# Altium project cntrler.PrjPcb
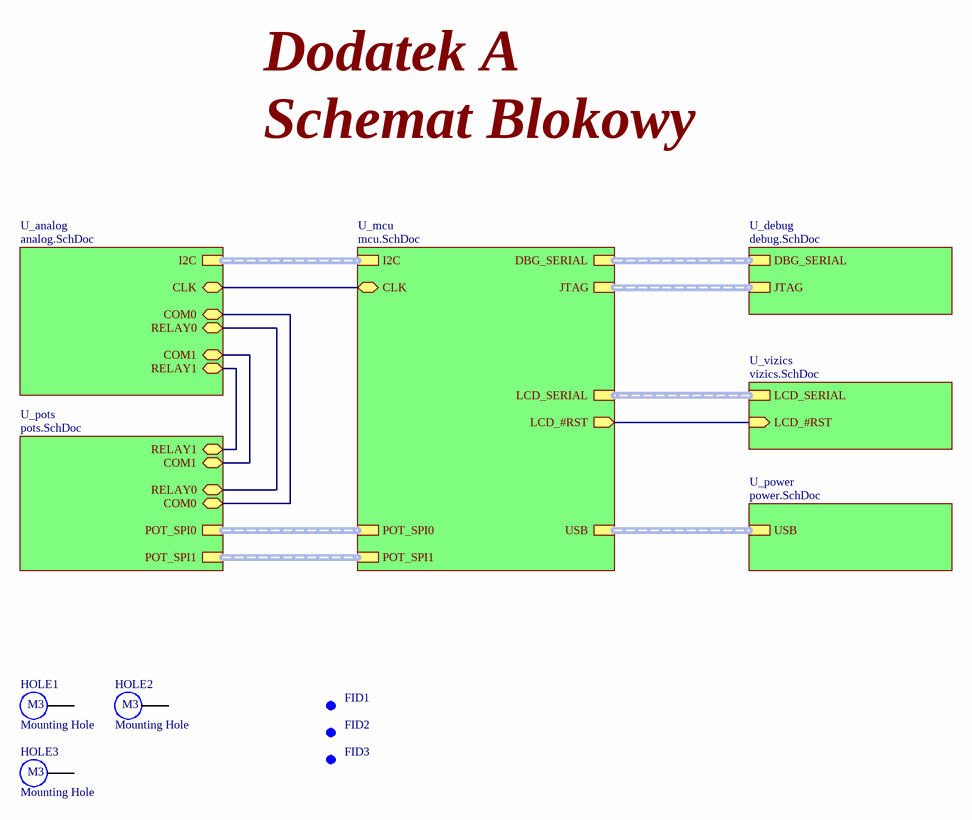
[diagram p0: sntrler.SchDoc]
7 sheets, 170 parts. Net scope: hierarchical (ports join the sheet entries above them; power ports are global).
Board file: pycyby.PcbDoc
Sheets:
  sntrler.SchDoc
    U_analog = analog.SchDoc
    U_mcu = mcu.SchDoc
    U_debug = debug.SchDoc
    U_pots = pots.SchDoc
    U_power = power.SchDoc
    U_vizics = vizics.SchDoc

## Sheet sntrler.SchDoc: Scalony Skaner Bioimpedancji
size A4; DrawnBy: Łukasz Przeniosło; Organization: Zachodniopomorski; Address1: Uniwersytet Technologiczny; Address2: w Szczecinie; Address3: Wydział Elektryczny; Address4: Katedra KISSE; Revision: 1.0; SheetNumber: 1; SheetTotal: 7

### Parts
FID1  Fiducial  [Fid Round]  (value not drawn)  (no BOM)
FID2  Fiducial  [Fid Round]  (value not drawn)  (no BOM)
FID3  Fiducial  [Fid Round]  (value not drawn)  (no BOM)
HOLE1  Mounting Hole  [Hole3.2x6mm]  (no BOM)
HOLE2  Mounting Hole  [Hole3.2x6mm]  (no BOM)
HOLE3  Mounting Hole  [Hole3.2x6mm]  (no BOM)

### Sub-sheets
U_analog = analog.SchDoc: I2C (harness I2C), COM0 (bidir), RELAY0 (bidir), COM1 (bidir), RELAY1 (bidir), CLK (bidir)
U_debug = debug.SchDoc: DBG_SERIAL (harness DBG_SERIAL), JTAG (harness JTAG)
U_mcu = mcu.SchDoc: JTAG (harness JTAG), LCD_SERIAL (harness LCD_SERIAL), I2C (harness I2C), DBG_SERIAL (harness DBG_SERIAL), POT_SPI0 (harness POT_SPI0), USB (harness USB), LCD_#RST (out), POT_SPI1 (harness POT_SPI1), CLK (bidir)
U_pots = pots.SchDoc: POT_SPI0 (harness POT_SPI0), POT_SPI1 (harness POT_SPI1), COM0 (bidir), RELAY0 (bidir), COM1 (bidir), RELAY1 (bidir)
U_power = power.SchDoc: USB (harness USB)
U_vizics = vizics.SchDoc: LCD_SERIAL (harness LCD_SERIAL), LCD_#RST (in)

### Nets
CLK: sheet U_analog/CLK, sheet U_mcu/CLK
COM0: sheet U_analog/COM0, sheet U_pots/COM0
COM1: sheet U_analog/COM1, sheet U_pots/COM1
LCD_#RST: sheet U_mcu/LCD_#RST, sheet U_vizics/LCD_#RST
MUT_IN0: sheet U_analog/RELAY0, sheet U_pots/RELAY0
MUT_IN1: sheet U_analog/RELAY1, sheet U_pots/RELAY1

Not connected (* = marked no-connect by the designer): HOLE1 0; HOLE2 0; HOLE3 0

### Buses and harness runs
harness sheet U_analog/I2C = sheet U_mcu/I2C
harness sheet U_debug/DBG_SERIAL = sheet U_mcu/DBG_SERIAL
harness sheet U_debug/JTAG = sheet U_mcu/JTAG
harness sheet U_mcu/LCD_SERIAL = sheet U_vizics/LCD_SERIAL
harness sheet U_mcu/POT_SPI0 = sheet U_pots/POT_SPI0
harness sheet U_mcu/POT_SPI1 = sheet U_pots/POT_SPI1
harness sheet U_mcu/USB = sheet U_power/USB

### Notes on the sheet
- Dodatek A
- Schemat Blokowy
- Title
- Size:
- Date:
- A4
- Author:
- Time:
- Sheet
- of
- File:
- (in symbol HOLE M3) M3

### Library data of the parts
FID1-FID3 = FID ROUND: round fiducial
HOLE1-HOLE3 = HOLE M3

## Sheet analog.SchDoc: Scalony Skaner Bioimpedancji
size A4; DrawnBy: Łukasz Przeniosło; Organization: Zachodniopomorski; Address1: Uniwersytet Technologiczny; Address2: w Szczecinie; Address3: Wydział Elektryczny; Address4: Katedra KISSE; Revision: 1.0; SheetNumber: 3; SheetTotal: 7
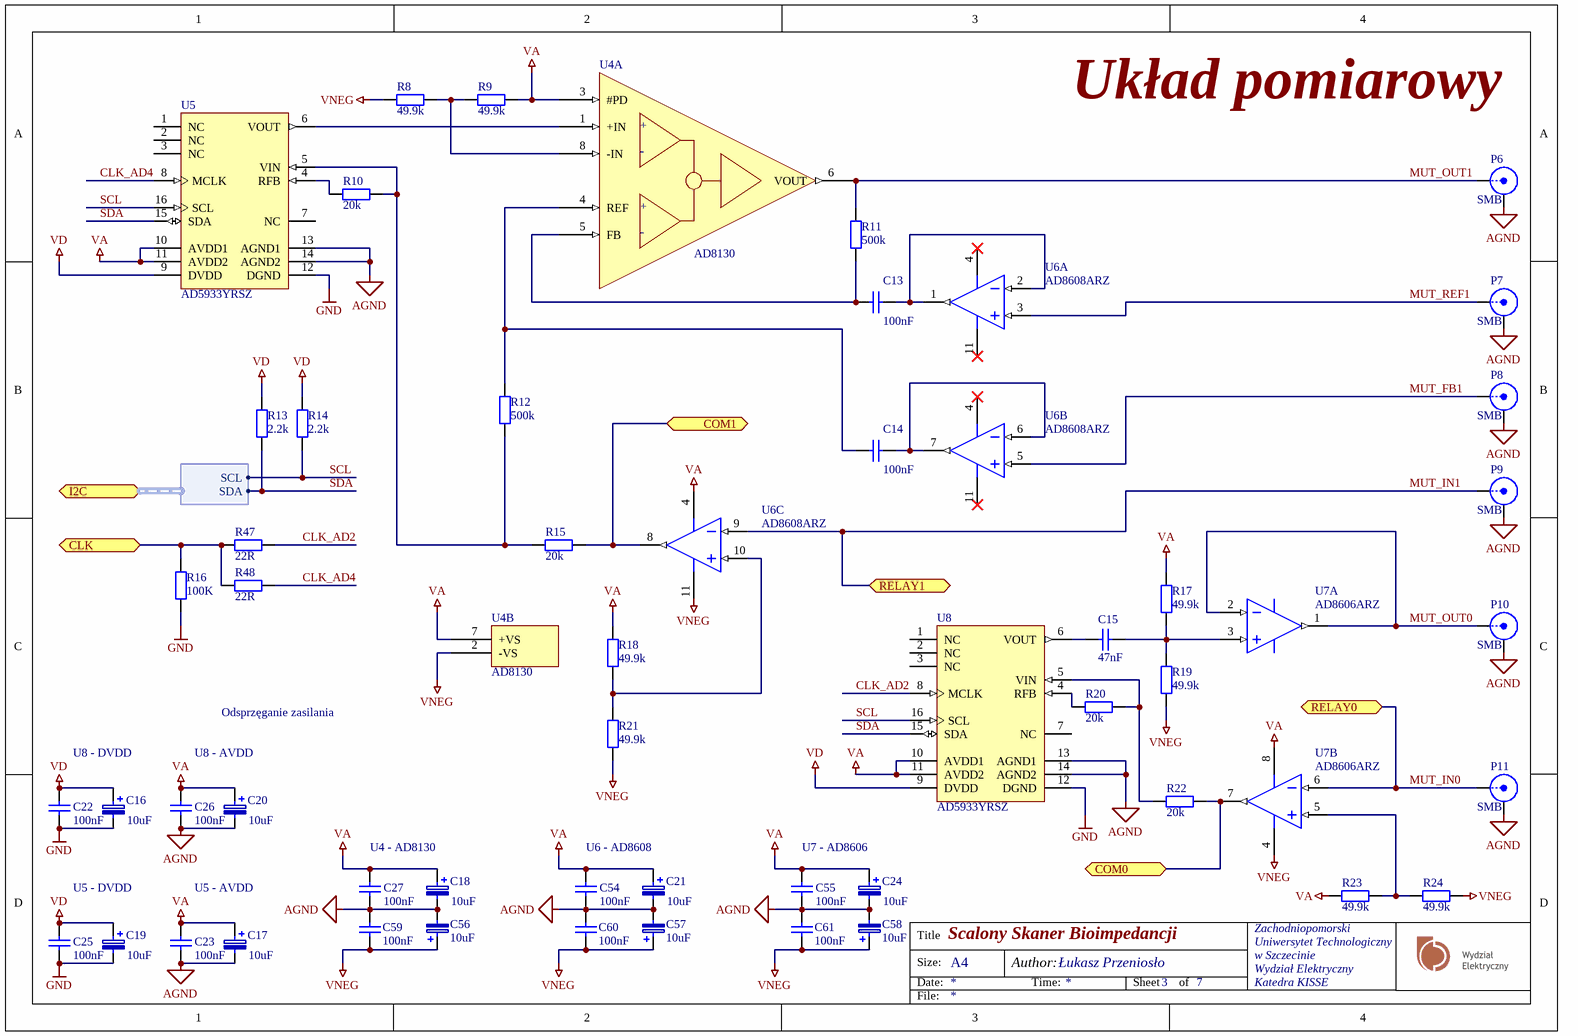
[diagram p1: analog.SchDoc]

### Parts
(Parts that share a designator on the sheet are numbered #1, #2 ... from top to bottom, then left to right.)
C13  100nF  [CAPC1608N]
C14  100nF  [CAPC1608N]
C15  47nF  [CAPC1608N]
C16  10uF  [SMDA]
C17  10uF  [SMDA]
C18  10uF  [SMDA]
C19  10uF  [SMDA]
C20  10uF  [SMDA]
C21  10uF  [SMDA]
C22  100nF  [CAPC1608N]
C23  100nF  [CAPC1608N]
C24  10uF  [SMDA]
C25  100nF  [CAPC1608N]
C26  100nF  [CAPC1608N]
C27  100nF  [CAPC1608N]
C54  100nF  [CAPC1608N]
C55  100nF  [CAPC1608N]
C56  10uF  [SMDA]
C57  10uF  [SMDA]
C58  10uF  [SMDA]
C59  100nF  [CAPC1608N]
C60  100nF  [CAPC1608N]
C61  100nF  [CAPC1608N]
P6  SMB  [SMB_V-RJ45]
P7  SMB  [SMB_V-RJ45]
P8  SMB  [SMB_V-RJ45]
P9  SMB  [SMB_V-RJ45]
P10  SMB  [SMB_V-RJ45]
P11  SMB  [SMB_V-RJ45]
R8  49.9k  [RESC1608N]
R9  49.9k  [RESC1608N]
R10  20k  [RESC1608N]
R11  500k  [RESC1608N]
R12  500k  [RESC1608N]
R13  2.2k  [RESC1608N]
R14  2.2k  [RESC1608N]
R15  20k  [RESC1608N]
R16  100K  [RESC1608N]
R17  49.9k  [RESC1608N]
R18  49.9k  [RESC1608N]
R19  49.9k  [RESC1608N]
R20  20k  [RESC1608N]
R21  49.9k  [RESC1608N]
R22  20k  [RESC1608N]
R23  49.9k  [RESC1608N]
R24  49.9k  [RESC1608N]
R47  22R  [RESC1608N]
R48  22R  [RESC1608N]
U4  AD8130  [SO-8_M]  (parts A,B of 2)
U5  AD5933YRSZ  [ADI-RS-16_L]
U6  AD8608ARZ  [ADI-R-14_N]  (parts A,B,C of 4)
U7#1  AD8606ARZ  [SOIC127P600-8AL]  (part A of 2)
U7#2  AD8606ARZ  [SOIC127P600-8AL]  (part B of 2)
U8  AD5933YRSZ  [ADI-RS-16_L]

### Ports
CLK, COM0, COM1, I2C (harness I2C), RELAY0, RELAY1

### Harnesses
I2C: SCL, SDA

### Nets
AGND: C17.2 C18.2 C20.2 C21.2 C23.1 C24.2 C26.1 C27.1 C54.1 C55.1 C56.2 C57.2 C58.2 C59.1 C60.1 C61.1 P6.2(Y) P7.2(Y) P8.2(Y) P9.2(Y) P10.2(Y) P11.2(Y) U5.13(AGND1) U5.14(AGND2) U8.13(AGND1) U8.14(AGND2)
GND: C16.2 C19.2 C22.1 C25.1 R16.2 U5.12(DGND) U8.12(DGND)
VA: C17.1 C18.1 C20.1 C21.1 C23.2 C24.1 C26.2 C27.2 C54.2 C55.2 R9.1 R17.1 R18.1 R23.1 U4.3(#PD) U4.7(+VS) U5.10(AVDD1) U5.11(AVDD2) U6.4(+V) U7#2.8(+V) U8.10(AVDD1) U8.11(AVDD2)
VD: C16.1 C19.1 C22.2 C25.2 R13.1 R14.1 U5.9(DVDD) U8.9(DVDD)
VNEG: C56.1 C57.1 C58.1 C59.2 C60.2 C61.2 R8.2 R19.2 R21.2 R24.2 U4.2(-VS) U6.11(-V) U7#2.4(-V)
CLK: R16.1 R47.2 R48.2 ; port CLK
CLK_AD2: R47.1 U8.8(MCLK)
CLK_AD4: R48.1 U5.8(MCLK)
COM0: R22.1 U7#2.7(OUT_B) ; port COM0
COM1: R15.1 U6.8(OUT_C) ; port COM1
MUT_FB1: P8.1(X) U6.5(+IN_B)
MUT_IN0: P11.1(X) U7#2.6(-IN_B) ; port RELAY0
MUT_IN1: P9.1(X) U6.9(-IN_C) ; port RELAY1
MUT_OUT0: P10.1(X) U7#1.1(OUT_A) U7#1.2(-IN_A)
MUT_OUT1: P6.1(X) R11.1 U4.6(VOUT)
MUT_REF1: P7.1(X) U6.3(+IN_A)
SCL: R14.2 U5.16(SCL) U8.16(SCL) ; port I2C.SCL
SDA: R13.2 U5.15(SDA) U8.15(SDA) ; port I2C.SDA
NetC13_1: C13.1 U6.1(OUT_A) U6.2(-IN_A)
NetC13_2: C13.2 R11.2 U4.5(FB)
NetC14_1: C14.1 U6.6(-IN_B) U6.7(OUT_B)
NetC14_2: C14.2 R12.1 U4.4(REF)
NetC15_1: C15.1 R17.2 R19.1 U7#1.3(+IN_A)
NetC15_2: C15.2 U8.6(VOUT)
NetR8_1: R8.1 R9.2 U4.8(-IN)
NetR10_1: R10.1 R12.2 R15.2 U5.5(VIN)
NetR10_2: R10.2 U5.4(RFB)
NetR18_2: R18.2 R21.1 U6.10(+IN_C)
NetR20_1: R20.1 U8.4(RFB)
NetR20_2: R20.2 R22.2 U8.5(VIN)
NetR23_2: R23.2 R24.1 U7#2.5(+IN_B)
NetU4_1: U4.1(+IN) U5.6(VOUT)

Not connected (* = marked no-connect by the designer): U5 1(NC) 2(NC) 3(NC) 7(NC); U7#1 4(-V) 8(+V); U8 1(NC) 2(NC) 3(NC) 7(NC)

### Notes on the sheet
- Układ pomiarowy
- Odsprzęganie zasilania
- U8 - DVDD
- U8 - AVDD
- U4 - AD8130
- U6 - AD8608
- U7 - AD8606
- U5 - DVDD
- U5 - AVDD
- Title
- Size:
- Date:
- A4
- Author:
- Time:
- Sheet
- of
- File:
- (in symbol AD8130, part A) +; -

### Library data of the parts
C13-C15 C22 C23 C25-C27 C54 C55 C59-C61 = Capacitor
  C13 C14 C22 C23 C25-C27 C54 C55 C59-C61: Value: 100nF
  C15: Value: 47nF
C16-C21 C24 C56-C58 = 100uF 6.3V-SMDB: Polarized Capacitor (Surface Mount); PackageReference: SMDB; Manufacturer: *; Manufacturer Part No.: *; Distributor: tme.pl; Distributor Order Code: TC 100/6.3-SMDB; tme.pl: TC 100/6.3-SMDB; Value: 10uF; farnell: 1135048
P6-P11 = SMB: SMB Straight Connector; LatestRevisionDate: 17-Jul-2002; LatestRevisionNote: Re-released for DXP Platform.; Publisher: Altium Limited
R8-R12 R15 R17-R24 R47 R48 = Resistor: Tolerance: 5%; Power: 0W
  R8 R9 R17-R19 R21 R23 R24: Value: 49.9k
  R10 R15 R20 R22: Value: 20k
  R11 R12: Value: 500k
  R47 R48: Value: 22R
R13 R14 R16 = Resistor: Power: 0W; Tolerance: 5%
  R13 R14: Value: 2.2k
  R16: Value: 100K
U5 U8 = CMP-0293-00046-1: 1 MSPS, 12-Bit Impedance Converter, Network Analyzer, Serial, RS-16, 77 Tube, Pb-Free; Tuning Word Width (bits): 27bit; I Supply total (max): 15mA; Master fclk: 16.776MHz; Resolution (Bits): 12bit; PackageVersion: 3/17/2005; I/O Interface: Serial; ComponentLink2URL: http://www.analog.com/static/imported-files/data_sheets/AD5933.pdf; PackageReference: RS-16; ComponentLink2Description: Datasheet; ComponentLink1URL: www.analog.com; Code_JEDEC: MO-150-AC; PackageDescription: 16-Lead Shrink Small Outline Package [SSOP]; ComponentLink1Description: Manufacturer URL; ComponentLink3URL: http://www.analog.com/static/imported-files/packages/31572257652246RS_16.pdf; ComponentLink3Description: Package Specification; DatasheetVersion: Rev. D
U6 = CMP-0384-00479-2: Quad Channel Wide Bandwidth Operational Amplifier, 10 MHz BW, 5 V/us SR, Industrial, 14-pin SOIC (R-14), Tube; Manufacturer: Analog Devices; Generic Part Number: AD8608; V Span Min: 2.7V; V Span Max: 6V; Input Bias Current: 200fA; Amplifiers Per Package: 4; Small Signal Bandwidth: 10MHz; Input Offset Voltage: 20uV; Slew Rate: 5V/us; Iq/Amp: 1.2mA; PackageReference: R-14; Mounting Technology: Surface Mount; ComponentLink3URL: http://www.analog.com/static/imported-files/packages/PKG_PDF/SOIC_Narrow%20(R)/R_14.pdf; ComponentLink1Description: Manufacturer URL; PackageVersion: 060606-A; ComponentLink3Description: Package Specification; ComponentLink1URL: http://www.analog.com/en/index.html; ComponentLink4Description: Reference Circuit; ComponentLink2URL: http://www.analog.com/static/imported-files/data_sheets/AD8605_8606_8608.pdf; DatasheetVersion: Rev. L; RevisionNote: Reference Circuit URL fixed; PackageDescription: 14-Pin Standard Small Outline Package, Body 8.65 x 3.9 mm, Pitch 1.27 mm; ComponentLink2Description: Datasheet; Code_JEDEC: MS-012-AB; PartNumber: AD8608ARZ; ComponentLink4URL: http://www.analog.com/en/all-operational-amplifiers-op-amps/operational-amplifiers-op-amps/ad8608/products/product.html#product-recommendations
U7#1 U7#2 = CMP-0384-01321-1: Double Channel Wide Bandwidth Operational Amplifier, 10 MHz BW, 5 V/us SR, Industrial, 8-pin SOIC (R-8), Tube; Generic Part Number: AD8606; Manufacturer: Analog Devices; Small Signal Bandwidth: 10MHz; V Span Min: 2.7V; Input Offset Voltage: 20uV; Amplifiers Per Package: 2; Iq/Amp: 1.2mA; Input Bias Current: 200fA; V Span Max: 6V; Slew Rate: 5V/us; ComponentLink3URL: http://www.analog.com/static/imported-files/packages/PKG_PDF/SOIC_Narrow%20(R)/R_8.pdf; Code_JEDEC: MS-012-AA; Mounting Technology: Surface Mount; PackageVersion: 060506-A; ComponentLink1URL: http://www.analog.com/en/index.html; PackageDescription: 8-Pin Standard Small Outline Package, Body 3.9 x 4.9 mm, Pitch 1.27 mm; ComponentLink4URL: Reference Circuit:http://www.analog.com/en/all-operational-amplifiers-op-amps/operational-amplifiers-op-amps/ad8606/products/product.html#product-recommendations; ComponentLink3Description: Package Specification; ComponentLink1Description: Manufacturer URL; ComponentLink2URL: http://www.analog.com/static/imported-files/data_sheets/AD8605_8606_8608.pdf; ComponentLink2Description: Datasheet; PartNumber: AD8606ARZ; ComponentLink4Description: URL Link1; DatasheetVersion: Rev. L; PackageReference: R-8

## Sheet mcu.SchDoc: Scalony Skaner Bioimpedancji
size A4; DrawnBy: Łukasz Przeniosło; Organization: Zachodniopomorski; Address1: Uniwersytet Technologiczny; Address2: w Szczecinie; Address3: Wydział Elektryczny; Address4: Katedra KISSE; Revision: 1.0; SheetNumber: 4; SheetTotal: 7
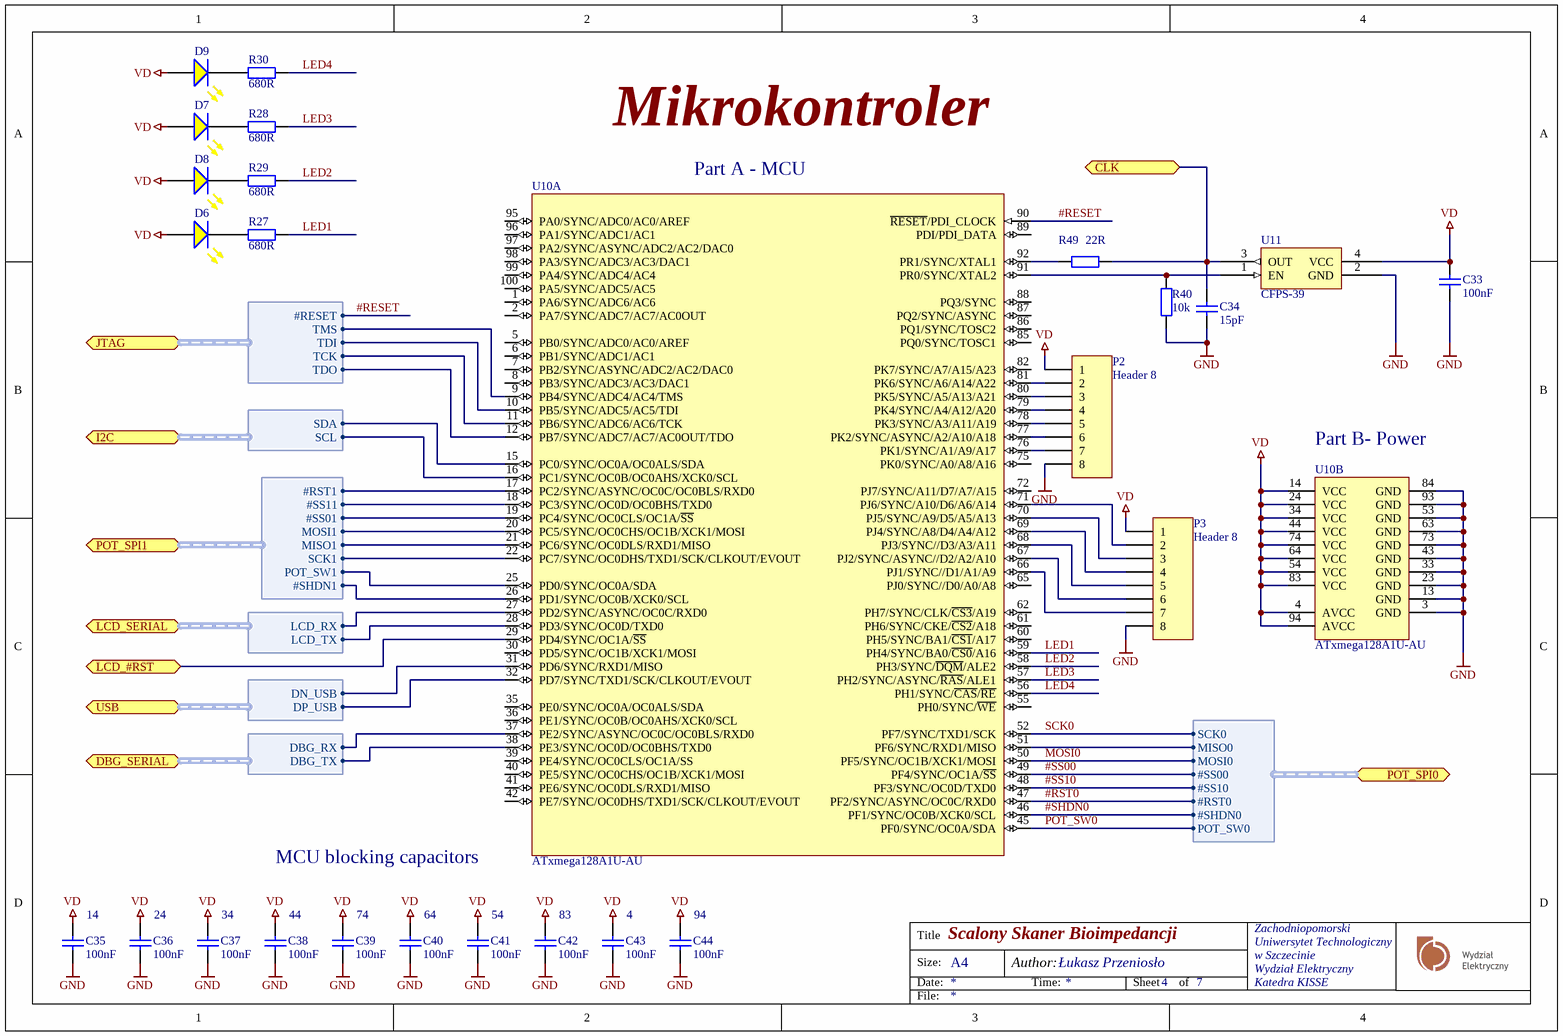
[diagram p2: mcu.SchDoc]

### Parts
C33  100nF  [CAPC1608N]
C34  15pF  [CAPC1608N]
C35  100nF  [CAPC1608N]
C36  100nF  [CAPC1608N]
C37  100nF  [CAPC1608N]
C38  100nF  [CAPC1608N]
C39  100nF  [CAPC1608N]
C40  100nF  [CAPC1608N]
C41  100nF  [CAPC1608N]
C42  100nF  [CAPC1608N]
C43  100nF  [CAPC1608N]
C44  100nF  [CAPC1608N]
D6  LED_YELLOW  [KPA-3010SGD]  (value not drawn)
D7  LED_YELLOW  [KPA-3010SGD]  (value not drawn)
D8  LED_YELLOW  [KPA-3010SGD]  (value not drawn)
D9  LED_YELLOW  [KPA-3010SGD]  (value not drawn)
P2  Header 8  [HDR1X8]
P3  Header 8  [HDR1X8]
R27  680R  [RESC1608N]
R28  680R  [RESC1608N]
R29  680R  [RESC1608N]
R30  680R  [RESC1608N]
R40  10k  [RESC1608N]
R49  22R  [RESC1608N]
U10  ATxmega128A1U-AU  [100A_MOJE]  (parts A,B of 2)
U11  CFPS-39  [ECX32]

### Ports
CLK, DBG_SERIAL (harness DBG_SERIAL), I2C (harness I2C), JTAG (harness JTAG), LCD_#RST, LCD_SERIAL (harness LCD_SERIAL), POT_SPI0 (harness POT_SPI0), POT_SPI1 (harness POT_SPI1), USB (harness USB)

### Harnesses
JTAG: TMS, TCK, TDI, TDO, #RESET
LCD_SERIAL: LCD_TX, LCD_RX
I2C: SDA, SCL
DBG_SERIAL: DBG_TX, DBG_RX
POT_SPI0: MISO0, MOSI0, SCK0, #SS00, #SS10, #RST0, #SHDN0, POT_SW0
USB: DP_USB, DN_USB
POT_SPI1: MISO1, MOSI1, SCK1, #SS01, #SS11, #RST1, #SHDN1, POT_SW1

### Nets
GND: C33.1 C34.1 C35.1 C36.1 C37.1 C38.1 C39.1 C40.1 C41.1 C42.1 C43.1 C44.1 P2.8 P3.8 R40.1 U10.3(GND) U10.13(GND) U10.23(GND) U10.33(GND) U10.43(GND) U10.53(GND) U10.63(GND) U10.73(GND) U10.84(GND) U10.93(GND) U11.2(GND)
VD: C33.2 C35.2 C36.2 C37.2 C38.2 C39.2 C40.2 C41.2 C42.2 C43.2 C44.2 D6.1(A) D7.1(A) D8.1(A) D9.1(A) P2.1 P3.1 U10.4(AVCC) U10.14(VCC) U10.24(VCC) U10.34(VCC) U10.44(VCC) U10.54(VCC) U10.64(VCC) U10.74(VCC) U10.83(VCC) U10.94(AVCC) U11.4(VCC)
#RESET: U10.90(~{RESET}/PDI_CLOCK) ; port JTAG.#RESET
#RST0: U10.47(PF2/SYNC/ASYNC/OC0C/RXD0) ; port POT_SPI0.#RST0
#RST1: U10.17(PC2/SYNC/ASYNC/OC0C/OC0BLS/RXD0) ; port POT_SPI1.#RST1
#SHDN0: U10.46(PF1/SYNC/OC0B/XCK0/SCL) ; port POT_SPI0.#SHDN0
#SHDN1: U10.26(PD1/SYNC/OC0B/XCK0/SCL) ; port POT_SPI1.#SHDN1
#SS00: U10.49(PF4/SYNC/OC1A/~{SS}) ; port POT_SPI0.#SS00
#SS01: U10.19(PC4/SYNC/OC0CLS/OC1A/~{SS}) ; port POT_SPI1.#SS01
#SS10: U10.48(PF3/SYNC/OC0D/TXD0) ; port POT_SPI0.#SS10
#SS11: U10.18(PC3/SYNC/OC0D/OC0BHS/TXD0) ; port POT_SPI1.#SS11
CLK: C34.2 R49.1 U11.3(OUT) ; port CLK
DBG_RX: U10.37(PE2/SYNC/ASYNC/OC0C/OC0BLS/RXD0) ; port DBG_SERIAL.DBG_RX
DBG_TX: U10.38(PE3/SYNC/OC0D/OC0BHS/TXD0) ; port DBG_SERIAL.DBG_TX
LCD_#RST: U10.29(PD4/SYNC/OC1A/~{SS}) ; port LCD_#RST
LCD_RX: U10.27(PD2/SYNC/ASYNC/OC0C/RXD0) ; port LCD_SERIAL.LCD_RX
LCD_TX: U10.28(PD3/SYNC/OC0D/TXD0) ; port LCD_SERIAL.LCD_TX
LED1: R27.1 U10.59(PH4/SYNC/BA0/~{CS0}/A16)
LED2: R29.1 U10.58(PH3/SYNC/~{DQM}/ALE2)
LED3: R28.1 U10.57(PH2/SYNC/ASYNC/~{RAS}/ALE1)
LED4: R30.1 U10.56(PH1/SYNC/~{CAS}/~{RE})
MOSI0: U10.50(PF5/SYNC/OC1B/XCK1/MOSI) ; port POT_SPI0.MOSI0
MOSI1: U10.20(PC5/SYNC/OC0CHS/OC1B/XCK1/MOSI) ; port POT_SPI1.MOSI1
POT_SW0: U10.45(PF0/SYNC/OC0A/SDA) ; port POT_SPI0.POT_SW0
POT_SW1: U10.25(PD0/SYNC/OC0A/SDA) ; port POT_SPI1.POT_SW1
SCK0: U10.52(PF7/SYNC/TXD1/SCK) ; port POT_SPI0.SCK0
SCK1: U10.22(PC7/SYNC/OC0DHS/TXD1/SCK/CLKOUT/EVOUT) ; port POT_SPI1.SCK1
SCL: U10.16(PC1/SYNC/OC0B/OC0AHS/XCK0/SCL) ; port I2C.SCL
SDA: U10.15(PC0/SYNC/OC0A/OC0ALS/SDA) ; port I2C.SDA
TCK: U10.11(PB6/SYNC/ADC6/AC6/TCK) ; port JTAG.TCK
TDI: U10.10(PB5/SYNC/ADC5/AC5/TDI) ; port JTAG.TDI
TDO: U10.12(PB7/SYNC/ADC7/AC7/AC0OUT/TDO) ; port JTAG.TDO
TMS: U10.9(PB4/SYNC/ADC4/AC4/TMS) ; port JTAG.TMS
NetD6_2: D6.2(K) R27.2
NetD7_2: D7.2(K) R28.2
NetD8_2: D8.2(K) R29.2
NetD9_2: D9.2(K) R30.2
NetP2_2: P2.2 U10.81(PK6/SYNC/A6/A14/A22)
NetP2_3: P2.3 U10.80(PK5/SYNC/A5/A13/A21)
NetP2_4: P2.4 U10.79(PK4/SYNC/A4/A12/A20)
NetP2_5: P2.5 U10.78(PK3/SYNC/A3/A11/A19)
NetP2_6: P2.6 U10.77(PK2/SYNC/ASYNC/A2/A10/A18)
NetP2_7: P2.7 U10.76(PK1/SYNC/A1/A9/A17)
NetP3_2: P3.2 U10.71(PJ6/SYNC/A10/D6/A6/A14)
NetP3_3: P3.3 U10.70(PJ5/SYNC/A9/D5/A5/A13)
NetP3_4: P3.4 U10.69(PJ4/SYNC/A8/D4/A4/A12)
NetP3_5: P3.5 U10.68(PJ3/SYNC//D3/A3/A11)
NetP3_6: P3.6 U10.67(PJ2/SYNC/ASYNC//D2/A2/A10)
NetP3_7: P3.7 U10.66(PJ1/SYNC//D1/A1/A9)
NetR4_2: U10.31(PD6/SYNC/RXD1/MISO) ; port USB.DN_USB
NetR5_2: U10.32(PD7/SYNC/TXD1/SCK/CLKOUT/EVOUT) ; port USB.DP_USB
NetR40_2: R40.2 U10.91(PR0/SYNC/XTAL2) U11.1(EN)
NetR49_2: R49.2 U10.92(PR1/SYNC/XTAL1)
NetU10_21: U10.21(PC6/SYNC/OC0DLS/RXD1/MISO) ; port POT_SPI1.MISO1
NetU10_51: U10.51(PF6/SYNC/RXD1/MISO) ; port POT_SPI0.MISO0

Not connected (* = marked no-connect by the designer): U10 1(PA6/SYNC/ADC6/AC6) 2(PA7/SYNC/ADC7/AC7/AC0OUT) 5(PB0/SYNC/ADC0/AC0/AREF) 6(PB1/SYNC/ADC1/AC1) 7(PB2/SYNC/ASYNC/ADC2/AC2/DAC0) 8(PB3/SYNC/ADC3/AC3/DAC1) 30(PD5/SYNC/OC1B/XCK1/MOSI) 35(PE0/SYNC/OC0A/OC0ALS/SDA) 36(PE1/SYNC/OC0B/OC0AHS/XCK0/SCL) 39(PE4/SYNC/OC0CLS/OC1A/SS) 40(PE5/SYNC/OC0CHS/OC1B/XCK1/MOSI) 41(PE6/SYNC/OC0DLS/RXD1/MISO) 42(PE7/SYNC/OC0DHS/TXD1/SCK/CLKOUT/EVOUT) 55(PH0/SYNC/~{WE}) 60(PH5/SYNC/BA1/~{CS1}/A17) 61(PH6/SYNC/CKE/~{CS2}/A18) 62(PH7/SYNC/CLK/~{CS3}/A19) 65(PJ0/SYNC//D0/A0/A8) 72(PJ7/SYNC/A11/D7/A7/A15) 75(PK0/SYNC/A0/A8/A16) 82(PK7/SYNC/A7/A15/A23) 85(PQ0/SYNC/TOSC1) 86(PQ1/SYNC/TOSC2) 87(PQ2/SYNC/ASYNC) 88(PQ3/SYNC) 89(PDI/PDI_DATA) 95(PA0/SYNC/ADC0/AC0/AREF) 96(PA1/SYNC/ADC1/AC1) 97(PA2/SYNC/ASYNC/ADC2/AC2/DAC0) 98(PA3/SYNC/ADC3/AC3/DAC1) 99(PA4/SYNC/ADC4/AC4) 100(PA5/SYNC/ADC5/AC5)

### Notes on the sheet
- Mikrokontroler
- (near U10) Part A - MCU
- (near U10) Part B- Power
- (near C35) 14
- (near C36) 24
- (near C37) 34
- (near U10) MCU blocking capacitors
- (near C38) 44
- (near C39) 74
- (near C40) 64
- (near C41) 54
- (near C42) 83
- (near C43) 4
- (near C44) 94
- Title
- Size:
- Date:
- A4
- Author:
- Time:
- Sheet
- of
- File:

### Library data of the parts
C33-C44 = Capacitor
  C33 C35-C44: Value: 100nF
  C34: Value: 15pF
P2 P3 = Header 8: Header, 8-Pin; LatestRevisionDate: 17-Jul-2002; LatestRevisionNote: Re-released for DXP Platform.; Publisher: Altium Limited
R27-R30 R40 R49 = Resistor: Tolerance: 5%; Power: 0W
  R27-R30: Value: 680R
  R40: Value: 10k
  R49: Value: 22R
U10 = CMP-0094-00033-2: 8/16-bit AVR XMEGA A1 Microcontroller, 1.6-3.6V, 32MHz, 128KB + 8KB Flash, 2KB EEPROM, 8KB SRAM, 100-pin TQFP, Industrial Grade (-40°C to 85°C), Pb-Free; ComponentLink1Description: Manufacturer URL; Code_JEDEC: MS-026-AED; ComponentLink2Description: ATxmega64A1/128A1/192A1/256A1/384A1 Datasheet; PackageVersion: revD, Oct-2010; PackageDescription: 100-Pin Thin Profile Plastic Quad Flat Pack (TQFP), 14 x 14 x 1.0 mm Body, 0.5 mm Pitch; PackageReference: 100A; RevisionNote: DatasheetVersion & PackageVersion updated. URLs added.; DatasheetVersion: revM, Sep-2010; ComponentLink1URL: http://www.atmel.com/; ComponentLink2URL: http://www.atmel.com/dyn/resources/prod_documents/doc8067.pdf

## Sheet debug.SchDoc: Scalony Skaner Bioimpedancji
size A4; DrawnBy: Łukasz Przeniosło; Organization: Zachodniopomorski; Address1: Uniwersytet Technologiczny; Address2: w Szczecinie; Address3: Wydział Elektryczny; Address4: Katedra KISSE; Revision: 1.0; SheetNumber: 7; SheetTotal: 7
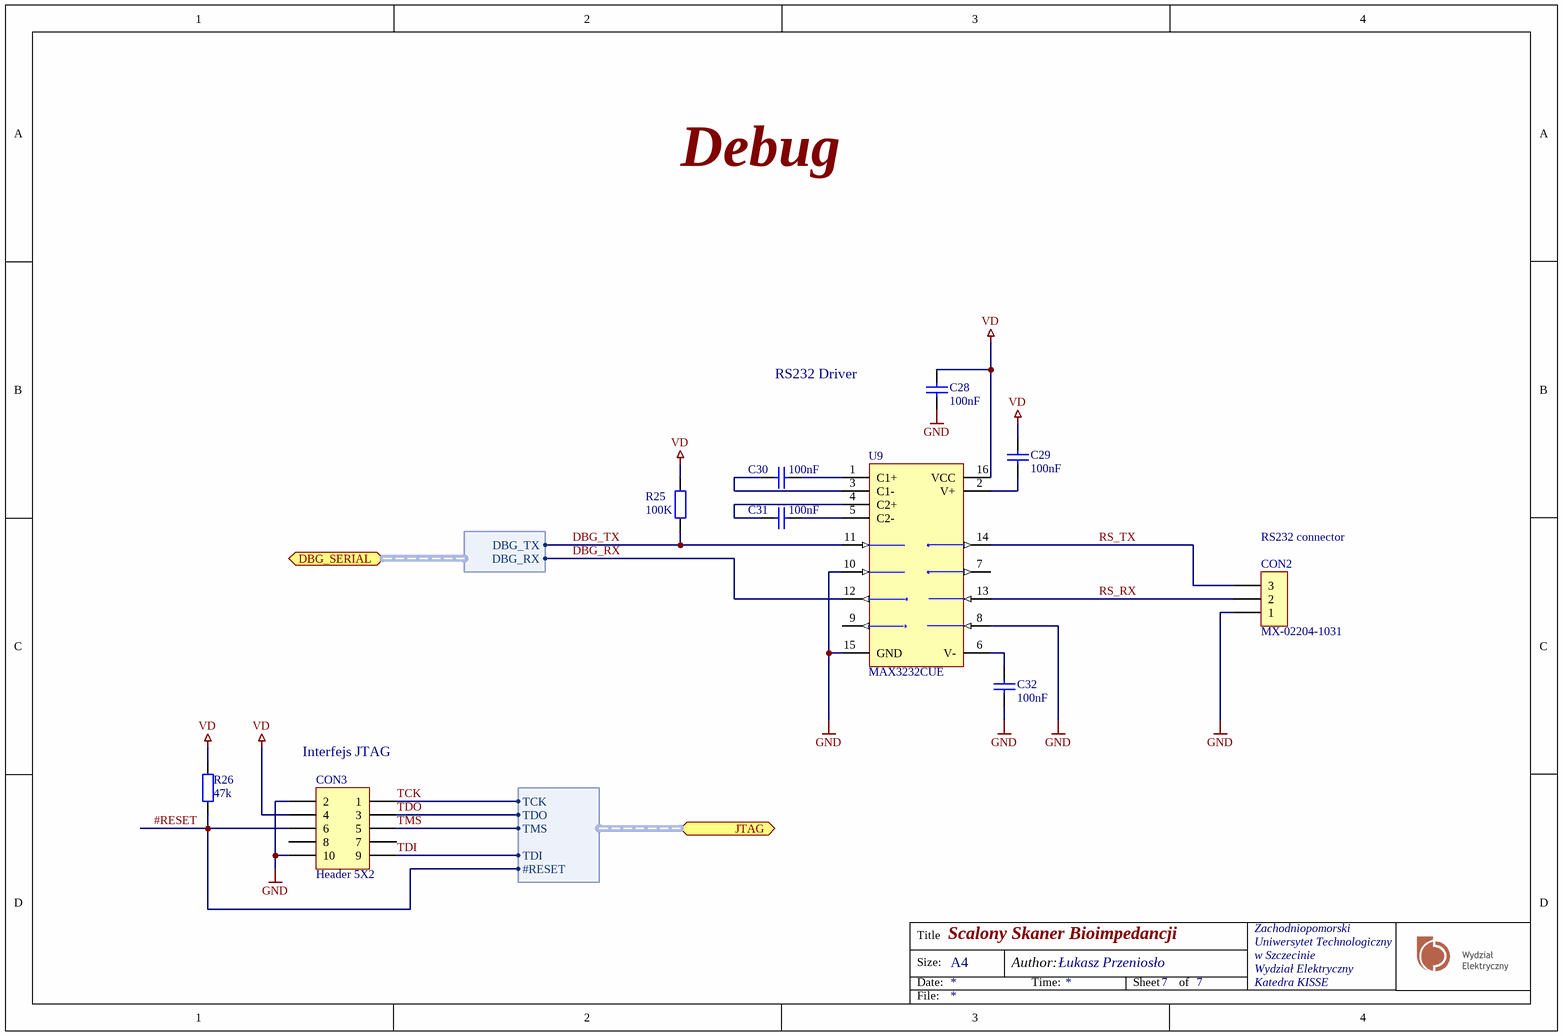
[diagram p3: debug.SchDoc]

### Parts
C28  100nF  [CAPC1608N]
C29  100nF  [CAPC1608N]
C30  100nF  [CAPC1608N]
C31  100nF  [CAPC1608N]
C32  100nF  [CAPC1608N]
CON2  MX-02204-1031  [MX-02204-1031]
CON3  Header 5X2  [918510X324]
R25  100K  [RESC1608N]
R26  47k  [RESC1608N]
U9  MAX3232CUE  [TI-D16_L_moje]

### Ports
DBG_SERIAL (harness DBG_SERIAL), JTAG (harness JTAG)

### Harnesses
DBG_SERIAL: DBG_TX, DBG_RX
JTAG: TMS, TCK, TDI, TDO, #RESET

### Nets
GND: C28.1 C32.1 CON2.1 CON3.2 CON3.10 U9.8(R2IN) U9.10(T2IN) U9.15(GND)
VD: C28.2 C29.2 CON3.4 R25.2 R26.2 U9.16(VCC)
#RESET: CON3.6 R26.1 ; port JTAG.#RESET
DBG_RX: U9.12(R1OUT) ; port DBG_SERIAL.DBG_RX
DBG_TX: R25.1 U9.11(T1IN) ; port DBG_SERIAL.DBG_TX
RS_RX: CON2.2 U9.13(R1IN)
RS_TX: CON2.3 U9.14(T1OUT)
TCK: CON3.1 ; port JTAG.TCK
TDI: CON3.9 ; port JTAG.TDI
TDO: CON3.3 ; port JTAG.TDO
TMS: CON3.5 ; port JTAG.TMS
NetC29_1: C29.1 U9.2(V+)
NetC30_1: C30.1 U9.3(C1-)
NetC30_2: C30.2 U9.1(C1+)
NetC31_1: C31.1 U9.4(C2+)
NetC31_2: C31.2 U9.5(C2-)
NetC32_2: C32.2 U9.6(V-)

Not connected (* = marked no-connect by the designer): CON3 7 8; U9 7(T2OUT) 9(R2OUT)

### Notes on the sheet
- Debug
- RS232 Driver
- (near CON2) RS232 connector
- (near CON3) Interfejs JTAG
- Title
- Size:
- Date:
- A4
- Author:
- Time:
- Sheet
- of
- File:

### Library data of the parts
C28-C32 = Capacitor: Value: 100nF
CON2 = MX-02204-1031: Pith 2.54mm, 3-pin; ComponentLink1Description: Manufacturer Link; ComponentLink2Description: Datasheet; Distributor: tme.pl; tme.pl: MX-6410-03A
CON3 = Header 5X2: Header, 5-Pin, Dual row; LatestRevisionDate: 17-Jul-2002; LatestRevisionNote: Re-released for DXP Platform.; Publisher: Altium Limited
R25 = Resistor: Power: 0W; Tolerance: 5%; Value: 100K
R26 = Resistor: Tolerance: 5%; Power: 0W; Value: 47k
U9 = MAX3232CUE: 3.0V TO 5.5V, Low-Power, up to 1Mbps, True RS-232 Transceiver Using Four 0.1µF External Capacitor; Published: 16-Jan-2001; LatestRevisionDate: 29-May-2009; LatestRevisionNote: IPC-7351 Footprint Added.; DatasheetVersion: Mar-1999; PackageVersion: 21-0066 C; PackageReference: TSSOP16; Publisher: Altium Limited; PackageDescription: 16-Pin Thin Small Outline Package 0.65 mm Pitch; ComponentLink1Description: Manufacturer Link; ComponentLink1URL: http://www.maxim-ic.com/; ComponentLink2Description: Datasheet; ComponentLink2URL: http://pdfserv.maxim-ic.com/en/ds/MAX3222-MAX3241.pdf

## Sheet pots.SchDoc: Scalony Skaner Bioimpedancji
size A4; DrawnBy: Łukasz Przeniosło; Organization: Zachodniopomorski; Address1: Uniwersytet Technologiczny; Address2: w Szczecinie; Address3: Wydział Elektryczny; Address4: Katedra KISSE; Revision: 1.0; SheetNumber: 6; SheetTotal: 7
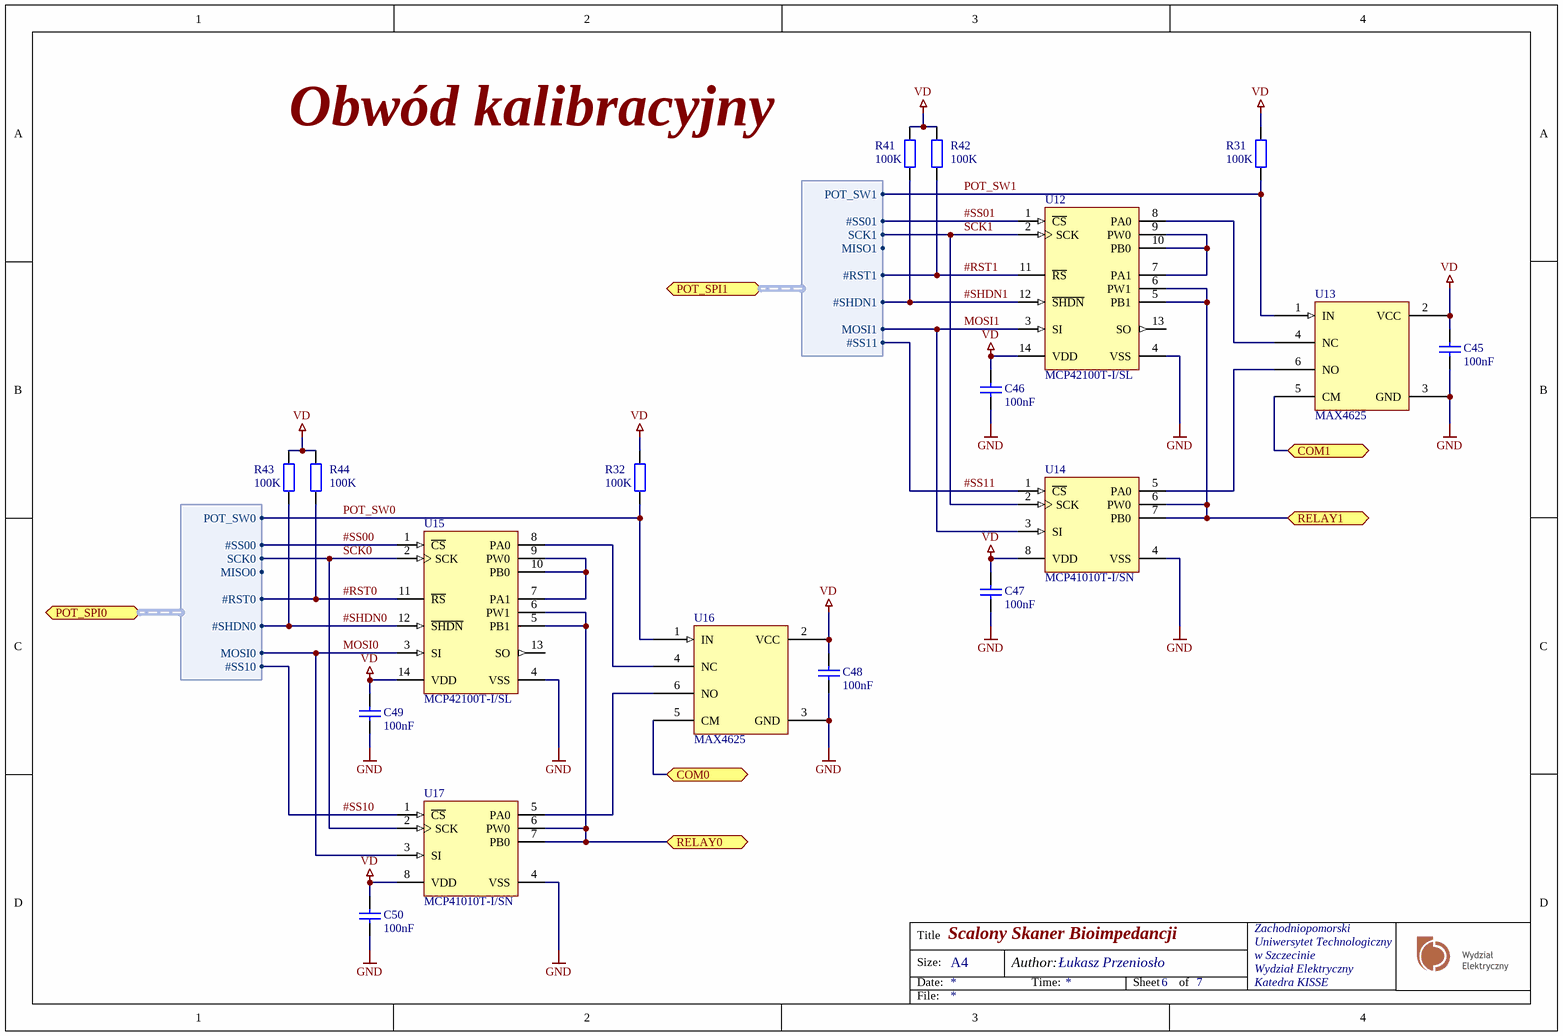
[diagram p4: pots.SchDoc]

### Parts
C45  100nF  [CAPC1608N]
C46  100nF  [CAPC1608N]
C47  100nF  [CAPC1608N]
C48  100nF  [CAPC1608N]
C49  100nF  [CAPC1608N]
C50  100nF  [CAPC1608N]
R31  100K  [RESC1608N]
R32  100K  [RESC1608N]
R41  100K  [RESC1608N]
R42  100K  [RESC1608N]
R43  100K  [RESC1608N]
R44  100K  [RESC1608N]
U12  MCP42100T-I/SL  [ADI-R-14_N]
U13  MAX4625  [SOT100P275-6L]
U14  MCP41010T-I/SN  [SOIC127P600-8AL]
U15  MCP42100T-I/SL  [ADI-R-14_N]
U16  MAX4625  [SOT100P275-6L]
U17  MCP41010T-I/SN  [SOIC127P600-8AL]

### Ports
COM0, COM1, POT_SPI0 (harness POT_SPI0), POT_SPI1 (harness POT_SPI1), RELAY0, RELAY1

### Harnesses
POT_SPI0: MISO0, MOSI0, SCK0, #SS00, #SS10, #RST0, #SHDN0, POT_SW0
POT_SPI1: MISO1, MOSI1, SCK1, #SS01, #SS11, #RST1, #SHDN1, POT_SW1

### Nets
GND: C45.1 C46.1 C47.1 C48.1 C49.1 C50.1 U12.4(VSS) U13.3(GND) U14.4(VSS) U15.4(VSS) U16.3(GND) U17.4(VSS)
VD: C45.2 C46.2 C47.2 C48.2 C49.2 C50.2 R31.2 R32.2 R41.2 R42.2 R43.2 R44.2 U12.14(VDD) U13.2(VCC) U14.8(VDD) U15.14(VDD) U16.2(VCC) U17.8(VDD)
#RST0: R44.1 U15.11(~{RS}) ; port POT_SPI0.#RST0
#RST1: R42.1 U12.11(~{RS}) ; port POT_SPI1.#RST1
#SHDN0: R43.1 U15.12(~{SHDN}) ; port POT_SPI0.#SHDN0
#SHDN1: R41.1 U12.12(~{SHDN}) ; port POT_SPI1.#SHDN1
#SS00: U15.1(~{CS}) ; port POT_SPI0.#SS00
#SS01: U12.1(~{CS}) ; port POT_SPI1.#SS01
#SS10: U17.1(~{CS}) ; port POT_SPI0.#SS10
#SS11: U14.1(~{CS}) ; port POT_SPI1.#SS11
COM0: U16.5(CM) ; port COM0
COM1: U13.5(CM) ; port COM1
MOSI0: U15.3(SI) U17.3(SI) ; port POT_SPI0.MOSI0
MOSI1: U12.3(SI) U14.3(SI) ; port POT_SPI1.MOSI1
MUT_IN0: U15.5(PB1) U15.6(PW1) U17.6(PW0) U17.7(PB0) ; port RELAY0
MUT_IN1: U12.5(PB1) U12.6(PW1) U14.6(PW0) U14.7(PB0) ; port RELAY1
POT_SW0: R32.1 U16.1(IN) ; port POT_SPI0.POT_SW0
POT_SW1: R31.1 U13.1(IN) ; port POT_SPI1.POT_SW1
SCK0: U15.2(SCK) U17.2(SCK) ; port POT_SPI0.SCK0
SCK1: U12.2(SCK) U14.2(SCK) ; port POT_SPI1.SCK1
NetU12_7: U12.7(PA1) U12.9(PW0) U12.10(PB0)
NetU12_8: U12.8(PA0) U13.4(NC)
NetU13_6: U13.6(NO) U14.5(PA0)
NetU15_7: U15.7(PA1) U15.9(PW0) U15.10(PB0)
NetU15_8: U15.8(PA0) U16.4(NC)
NetU16_6: U16.6(NO) U17.5(PA0)

Not connected (* = marked no-connect by the designer): U12 13(SO); U15 13(SO)

### Notes on the sheet
- Obwód kalibracyjny
- Title
- Size:
- Date:
- A4
- Author:
- Time:
- Sheet
- of
- File:

### Library data of the parts
C45-C50 = Capacitor: Value: 100nF
R31 R32 R41-R44 = Resistor: Power: 0W; Tolerance: 5%; Value: 100K
U12 U15 = CMP-0188-00459-2: Single/Dual Digital Potentiometer with SPI Interface, 14-Pin SOIC 150mil, Industrial Temperature, Tape and Reel; RevisionNote: URLs added.; ComponentLink3URL: http://www.microchip.com/stellent/groups/techpub_sg/documents/packagingspec/en012702.pdf; Code_JEDEC: MS-012-AB; ComponentLink2Description: Datasheet; ComponentLink1Description: Manufacturer URL; ComponentLink1URL: http://www.microchip.com/; ComponentLink2URL: http://ww1.microchip.com/downloads/en/DeviceDoc/11195c.pdf; DatasheetVersion: Jul-2003; PackageVersion: revBB, Aug-2009; PackageDescription: 14-Lead Plastic Small Outline (SL) - Narrow, 3.90mm Body [SOIC]; ComponentLink3Description: Package Specification; PackageReference: SOIC-SL14; Code_IPC: SOIC127P600-14
U14 U17 = CMP-0188-00466-2: Single/Dual Digital Potentiometer with SPI Interface, 8-Pin SOIC 150mil, Industrial Temperature, Tape and Reel; ComponentLink2URL: http://ww1.microchip.com/downloads/en/DeviceDoc/11195c.pdf; PackageReference: SOIC-SN8; PackageDescription: 8-Lead Plastic Small Outline (SN) - Narrow, 3.90mm Body [SOIC]; ComponentLink3URL: http://www.microchip.com/stellent/groups/techpub_sg/documents/packagingspec/en012702.pdf; ComponentLink2Description: Datasheet; Code_JEDEC: MS-012; ComponentLink1URL: http://www.microchip.com/; PackageVersion: revBB, Aug-2009; DatasheetVersion: Jul-2003; ComponentLink1Description: Manufacturer URL; ComponentLink3Description: Package Specification; Code_IPC: SOIC127P600-8; RevisionNote: URLs added.

## Sheet power.SchDoc: Scalony Skaner Bioimpedancji
size A4; DrawnBy: Łukasz Przeniosło; Organization: Zachodniopomorski; Address1: Uniwersytet Technologiczny; Address2: w Szczecinie; Address3: Wydział Elektryczny; Address4: Katedra KISSE; Revision: 1.0; SheetNumber: 2; SheetTotal: 7
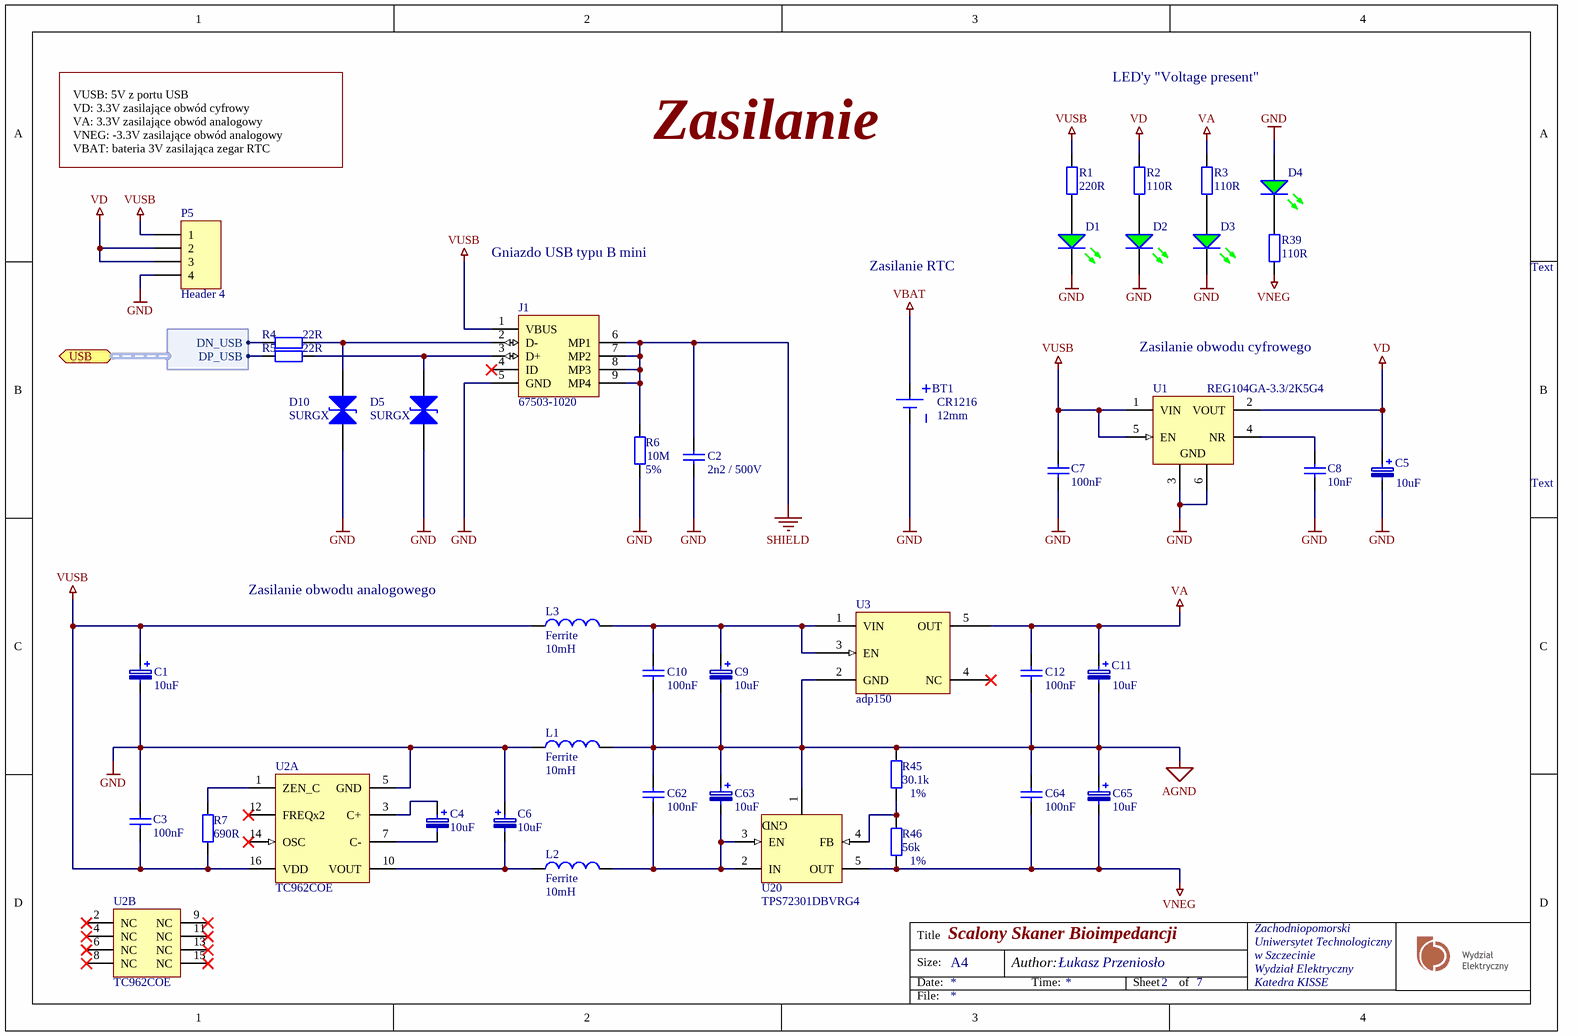
[diagram p5: power.SchDoc]

### Parts
BT1  CR1216  SIZE: 12mm  [12MM-BATTERY-HOLDER]
C1  10uF  [SMDA]
C2  2n2 / 500V  [CAPC3216N]
C3  100nF  [CAPC1608N]
C4  10uF  [SMDA]
C5  10uF  [SMDA]
C6  10uF  [SMDA]
C7  100nF  [CAPC1608N]
C8  10nF  [CAPC1608N]
C9  10uF  [SMDA]
C10  100nF  [CAPC1608N]
C11  10uF  [SMDA]
C12  100nF  [CAPC1608N]
C62  100nF  [CAPC1608N]
C63  10uF  [SMDA]
C64  100nF  [CAPC1608N]
C65  10uF  [SMDA]
D1  LL-S172GC-2A  [CD2012-0805]  (value not drawn)
D2  LL-S172GC-2A  [CD2012-0805]  (value not drawn)
D3  LL-S172GC-2A  [CD2012-0805]  (value not drawn)
D4  LL-S172GC-2A  [CD2012-0805]  (value not drawn)
D5  SURGX  [SURGX-0603]
D10  SURGX  [SURGX-0603]
J1  67503-1020  [MOLX-67503-1020_V]
L1  Ferrite  value 10mH  [FERRITE_1206]
L2  Ferrite  value 10mH  [FERRITE_1206]
L3  Ferrite  value 10mH  [FERRITE_1206]
P5  Header 4  [HDR1X4]
R1  220R  [RESC1608N]
R2  110R  [RESC1608N]
R3  110R  [RESC1608N]
R4  22R  [RESC1608N]
R5  22R  [RESC1608N]
R6  Tolerance: 5%  [RESC3216N]  (hidden comment: 10M)
R7  690R  [RESC1608N]
R39  110R  [RESC1608N]
R45  Tolerance: 1%  [RESC1608N]  (hidden comment: 30.1k)
R46  Tolerance: 1%  [RESC1608N]  (hidden comment: 56k)
U1  REG104GA-3.3/2K5G4  [TI-DCQ6_L]
U2  TC962COE  [SOIC-OE16_moje]  (parts A,B of 2)
U3  adp150  [SOT95P280X100-5N]
U20  TPS72301DBVRG4  [SOT95P280X100-5N]

### Ports
USB (harness USB)

### Harnesses
USB: DN_USB, DP_USB

### Nets
AGND: C9.2 C10.1 C11.2 C12.1 C62.2 C63.1 C64.2 C65.1 L1.2 R45.1 U3.2(GND) U20.1(GND)
GND: BT1.2(-) C1.2 C2.1 C3.1 C5.2 C6.1 C7.1 C8.1 D1.2(K) D2.2(K) D3.2(K) D4.1(A) D5.1 D10.1 J1.5(GND) L1.1 P5.4 R6.1 U1.3(GND) U1.6(GND) U2.5(GND)
SHIELD: C2.2 J1.6(MP1) J1.7(MP2) J1.8(MP3) J1.9(MP4) R6.2
VA: C11.1 C12.2 R3.2 U3.5(OUT)
VBAT: BT1.1(+)
VD: C5.1 P5.2 P5.3 R2.2 U1.2(VOUT)
VNEG: C64.1 C65.2 R39.1 R46.2 U20.5(OUT)
VUSB: C1.1 C3.2 C7.2 J1.1(VBUS) L3.1 P5.1 R1.2 R7.2 U1.1(VIN) U1.5(EN) U2.16(VDD)
NetC4_1: C4.1 U2.3(C+)
NetC4_2: C4.2 U2.7(C-)
NetC6_2: C6.2 L2.1 U2.10(VOUT)
NetC8_2: C8.2 U1.4(NR)
NetC9_1: C9.1 C10.2 L3.2 U3.1(VIN) U3.3(EN)
NetC62_1: C62.1 C63.2 L2.2 U20.2(IN) U20.3(EN)
NetD1_1: D1.1(A) R1.1
NetD2_1: D2.1(A) R2.1
NetD3_1: D3.1(A) R3.1
NetD4_2: D4.2(K) R39.2
NetD5_2: D5.2 J1.3(D+) R5.1
NetD10_2: D10.2 J1.2(D-) R4.1
NetR4_2: R4.2 ; port USB.DN_USB
NetR5_2: R5.2 ; port USB.DP_USB
NetR7_1: R7.1 U2.1(ZEN_C)
NetR45_2: R45.2 R46.1 U20.4(FB)

Not connected (* = marked no-connect by the designer): J1 4(ID)*; U2 2(NC)* 4(NC)* 6(NC)* 8(NC)* 9(NC)* 11(NC)* 12(FREQx2)* 13(NC)* 14(OSC)* 15(NC)*; U3 4(NC)*

### Notes on the sheet
- LED'y "Voltage present"
- VUSB: 5V z portu USB
  VD: 3.3V zasilające obwód cyfrowy
  VA: 3.3V zasilające obwód analogowy
  VNEG: -3.3V zasilające obwód analogowy
  VBAT: bateria 3V zasilająca zegar RTC
  GND: Masa układu
  AGND: Masa dla obwodu analogowego
- Zasilanie
- Gniazdo USB typu B mini
- Zasilanie RTC
- Text
- Zasilanie obwodu cyfrowego
- Zasilanie obwodu analogowego
- Title
- Size:
- Date:
- A4
- Author:
- Time:
- Sheet
- of
- File:

### Library data of the parts
BT1 = CMP-0438-00001-1: Lithium Battery Holder for CR2032 3V Cell; Manufacturer: TE Connectivity; PartNumber: 120591-1; Body Shape: Horizontal Cylindrical; Packing Type: Tray; ComponentLink2Description: Datasheet; ComponentLink2URL: http://www.te.com/commerce/DocumentDelivery/DDEController?Action=showdoc&DocId=Customer+Drawing%7F120591%7FH%7Fpdf%7FEnglish%7FENG_CD_120591_H.pdf%7F120591-1; DatasheetVersion: Rev. H, 01/2013; PackageReference: 120591-1; ComponentLink1Description: Manufacturer URL; Mounting Technology: Through Hole; PackageDescription: Lithium Battery Holder; ComponentLink1URL: http://www.te.com/
C1 = 10uF 10V-SMDA: Polarized Capacitor (Surface Mount); PackageReference: SMDA; Manufacturer: *; Manufacturer Part No.: *; Distributor: tme.pl; Distributor Order Code: TC 10/10-SMDA; tme.pl: TC 10/10-SMDA; Value: 10uF; farnell: 1457413
C2 C3 C7 C8 C10 C12 C62 C64 = Capacitor
  C2: Value: 2n2 / 500V
  C3 C7 C10 C12 C62 C64: Value: 100nF
  C8: Value: 10nF
C4-C6 C9 C11 C63 C65 = 100uF 6.3V-SMDB: Polarized Capacitor (Surface Mount); PackageReference: SMDB; Manufacturer: *; Manufacturer Part No.: *; Distributor: tme.pl; Distributor Order Code: TC 100/6.3-SMDB; tme.pl: TC 100/6.3-SMDB; Value: 10uF; farnell: 1135048
D1-D4 = Led Green: Typical GREEN LED; Manufacturer: Lucky Light; Value: LL-S172GC-2A
D5 D10 = SURGX: ESD Suppressor; ComponentLink1Description: Manufacturer Link; ComponentLink2Description: Datasheet; Distributor: tme.pl
J1 = CMP-0411-00002-1: USB, MINI, SMD, RA KME04-USBMU03A01; Manufacturer: Molex; ComponentLink1URL: http://www.molex.com/; PartNumber: 67503-1020; Mounting Technology: Surface Mount; ComponentLink1Description: Manufacturer URL; Terminal Pitch: 0.8 mm; DatasheetVersion: Rev F, 06/2009; ComponentLink2Description: Datasheet; PackageDescription: Mini USB Connector, SMT, Righer Angle; ComponentLink2URL: http://www.molex.com/pdm_docs/sd/675031020_sd.pdf; PackageReference: 67503-1020
L1-L3 = Inductor: Code_IEC: 1005; Published: 8-Jun-2000; LatestRevisionDate: 29-May-2009; LatestRevisionNote: IPC-7351 Footprint Added.; PackageReference: 0402-A; Publisher: Altium Limited; PackageDescription: Chip Inductor; Code_JEITA: 0402
P5 = Header 4: Header, 4-Pin; LatestRevisionDate: 17-Jul-2002; LatestRevisionNote: Re-released for DXP Platform.; Publisher: Altium Limited
R1-R5 R7 R39 = Resistor: Tolerance: 5%; Power: 0W
  R1: Value: 220R
  R2 R3 R39: Value: 110R
  R4 R5: Value: 22R
  R7: Value: 690R
R6 R45 R46 = Resistor: Power: 0W
  R6: Value: 10M
  R45: Value: 30.1k
  R46: Value: 56k
U1 = CMP-0395-00461-1: Single Output Fast Transient Response LDO, 1 A, Fixed 3.3 V Output, 2.1 to 15 V Input, 6-pin SOT-223 (DCQ), -40 to 85 degC, Green (RoHS & no Sb/Br); Manufacturer: Texas Instruments; SubFamily: Single Channel LDO; Fixed Output Options(V): 3.3; Vin(Min)(V): 2.1; Vin(Max)(V): 15; Iout(Max)(A): 1; Accuracy(%): 2; Vdo(Typ)(mV): 230; Iq(Typ)(mA): 0.6; Mounting Technology: Surface Mount; PackageVersion: 4202109/D; ComponentLink2Description: Datasheet; ComponentLink2URL: http://www.ti.com/general/docs/lit/getliterature.tsp?genericPartNumber=REG104-33&fileType=pdf; ComponentLink1URL: http://www.ti.com/; PackageDescription: 6-Pin Plastic Small Outline, Body 3.5 x 6.5 mm, Pitch 1.27 mm; PackageReference: DCQ6; ComponentLink3Description: Package Specification; DatasheetVersion: SBVS025G; Vout Adj(Min)(V): 3.3; Eco-Plan: Green (RoHS & no Sb/Br); ComponentLink3URL: http://www.ti.com/litv/pdf/mpds098c; Vout Adj(Max)(V): 3.3; ComponentLink1Description: Manufacturer URL; PartNumber: REG104GA-3.3/2K5G4
U2 = CMP-0132-00038-1: 80mA Charge Pump DC-to-DC Converter, 12kHz, 24kHz, 16-Pin SOIC 300mil, Commercial Temperature; PackageDescription: 16-Lead Plastic Small Outline (OE) - Wide 7.50mm Body [SOIC]; Code_JEDEC: MS-013-AA; Code_IPC: SOIC127P1030-16; PackageVersion: revBB, Aug-2009; PackageReference: SOIC-OE16; DatasheetVersion: revC, Jun-2006
U20 = CMP-0394-00389-1: Single Output LDO, 200 mA, Adjustable -10 to -1.2 V Output, -10 to -2.7 V Input, 5-pin SOT-23 (DBV), -40 to 125 degC, Green (RoHS & no Sb/Br); Manufacturer: Texas Instruments; Iout(Max)(A): 0.2; Iq(Typ)(mA): 0.13; Vdo(Typ)(mV): 280; SubFamily: Single Channel LDO; Accuracy(%): 2; ComponentLink1Description: Manufacturer URL; ComponentLink2Description: Datasheet; ComponentLink3URL: http://www.ti.com/litv/pdf/mpds018i; Code_JEDEC: MO-178; Vin(Min)(V): -10; ComponentLink1URL: http://www.ti.com/; PackageDescription: 5-Pin Plastic Small Outline, Body 1.60 Ã— 2.90 mm, Pitch 0.95 mm; ComponentLink3Description: Package Specification; Vout Adj(Min)(V): -10; Eco-Plan: Green (RoHS & no Sb/Br); PartNumber: TPS72301DBVRG4; Vin(Max)(V): -2.7; Mounting Technology: Surface Mount; PackageVersion: 4073253-4/K; DatasheetVersion: SLVS346B; Vout Adj(Max)(V): -1.2; ComponentLink2URL: http://www.ti.com/general/docs/lit/getliterature.tsp?genericPartNumber=TPS72301&fileType=pdf; PackageReference: DBV5

## Sheet vizics.SchDoc: Scalony Skaner Bioimpedancji
size A4; DrawnBy: Łukasz Przeniosło; Organization: Zachodniopomorski; Address1: Uniwersytet Technologiczny; Address2: w Szczecinie; Address3: Wydział Elektryczny; Address4: Katedra KISSE; Revision: 1.0; SheetNumber: 5; SheetTotal: 7
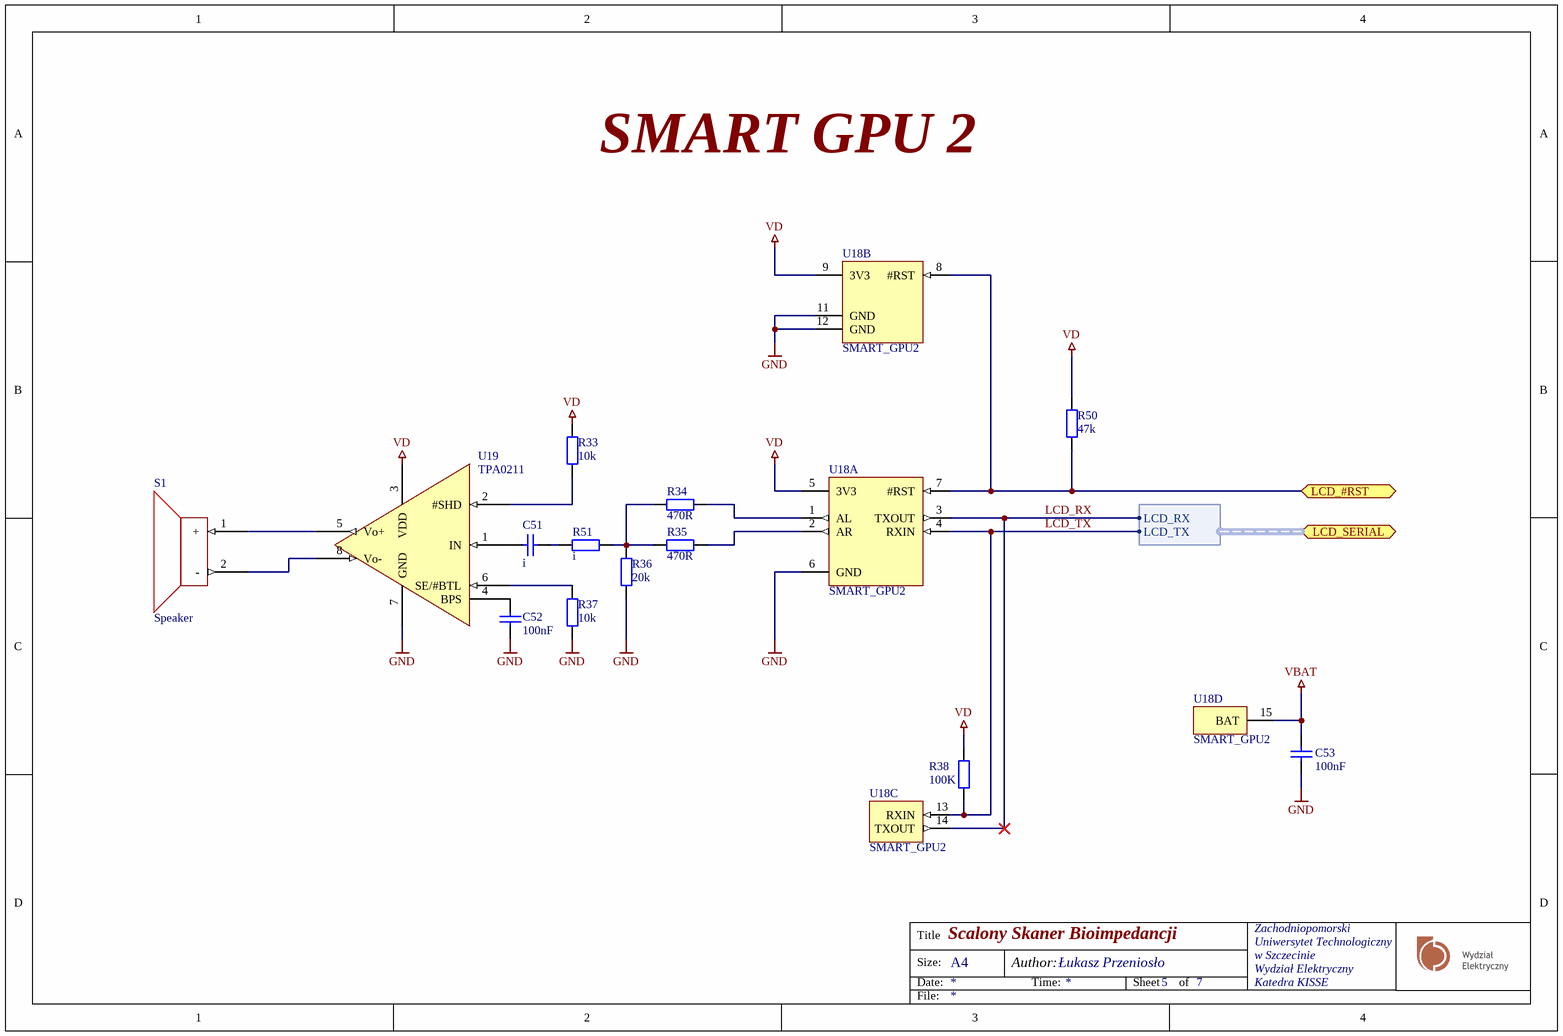
[diagram p6: vizics.SchDoc]

### Parts
C51  i  [CAPC1608N]
C52  100nF  [CAPC1608N]
C53  100nF  [CAPC1608N]
R33  10k  [RESC1608N]
R34  470R  [RESC1608N]
R35  470R  [RESC1608N]
R36  20k  [RESC1608N]
R37  10k  [RESC1608N]
R38  100K  [RESC1608N]
R50  47k  [RESC1608N]
R51  i  [RESC1608N]
S1  Speaker  [MX-02227-2021]
U18  SMART_GPU2  [LCD_HEADERS]  (parts A,B,C,D of 4)
U19  TPA0211  [SOIC127P600-8AL]

### Ports
LCD_#RST, LCD_SERIAL (harness LCD_SERIAL)

### Harnesses
LCD_SERIAL: LCD_TX, LCD_RX

### Nets
GND: C52.2 C53.1 R36.2 R37.1 U18.6(GND) U18.11(GND) U18.12(GND) U19.7(GND)
VBAT: C53.2 U18.15(BAT)
VD: R33.1 R38.2 R50.1 U18.5(3V3) U18.9(3V3) U19.3(VDD)
LCD_#RST: R50.2 U18.7(#RST) U18.8(#RST) ; port LCD_#RST
LCD_RX: U18.3(TXOUT) U18.14(TXOUT) ; port LCD_SERIAL.LCD_RX
LCD_TX: R38.1 U18.4(RXIN) U18.13(RXIN) ; port LCD_SERIAL.LCD_TX
NetC51_1: C51.1 R51.2
NetC51_2: C51.2 U19.1(IN)
NetC52_1: C52.1 U19.4(BPS)
NetR33_2: R33.2 U19.2(#SHD)
NetR34_1: R34.1 U18.1(AL)
NetR34_2: R34.2 R35.2 R36.1 R51.1
NetR35_1: R35.1 U18.2(AR)
NetR37_2: R37.2 U19.6(SE/#BTL)
NetS1_1: S1.1(+) U19.5(Vo+)
NetS1_2: S1.2(-) U19.8(Vo-)

Not connected (* = marked no-connect by the designer): U18 10(NC)

### Notes on the sheet
- SMART GPU 2
- Title
- Size:
- Date:
- A4
- Author:
- Time:
- Sheet
- of
- File:

### Library data of the parts
C51-C53 = Capacitor
  C51: Value: i
  C52 C53: Value: 100nF
R33-R37 R50 R51 = Resistor: Tolerance: 5%; Power: 0W
  R33 R37: Value: 10k
  R34 R35: Value: 470R
  R36: Value: 20k
  R50: Value: 47k
  R51: Value: i
R38 = Resistor: Power: 0W; Tolerance: 5%; Value: 100K

## Nets that join several sheets
AGND: analog (26 pins), power (12 pins)
GND: analog (7 pins), mcu (26 pins), debug (8 pins), pots (12 pins), power (21 pins), vizics (8 pins)
VA: analog (22 pins), power (C11.1 C12.2 R3.2 U3.5)
VBAT: power (BT1.1), vizics (C53.2 U18.15)
VD: analog (8 pins), mcu (28 pins), debug (6 pins), pots (18 pins), power (5 pins), vizics (6 pins)
VNEG: analog (13 pins), power (5 pins)
#RESET: mcu (U10.90), debug (CON3.6 R26.1)
#RST0: mcu (U10.47), pots (R44.1 U15.11)
#RST1: mcu (U10.17), pots (R42.1 U12.11)
#SHDN0: mcu (U10.46), pots (R43.1 U15.12)
#SHDN1: mcu (U10.26), pots (R41.1 U12.12)
#SS00: mcu (U10.49), pots (U15.1)
#SS01: mcu (U10.19), pots (U12.1)
#SS10: mcu (U10.48), pots (U17.1)
#SS11: mcu (U10.18), pots (U14.1)
CLK: analog (R16.1 R47.2 R48.2), mcu (C34.2 R49.1 U11.3)
COM0: analog (R22.1 U7#2.7), pots (U16.5)
COM1: analog (R15.1 U6.8), pots (U13.5)
DBG_RX: mcu (U10.37), debug (U9.12)
DBG_TX: mcu (U10.38), debug (R25.1 U9.11)
LCD_#RST: mcu (U10.29), vizics (R50.2 U18.7 U18.8)
LCD_RX: mcu (U10.27), vizics (U18.3 U18.14)
LCD_TX: mcu (U10.28), vizics (R38.1 U18.4 U18.13)
MOSI0: mcu (U10.50), pots (U15.3 U17.3)
MOSI1: mcu (U10.20), pots (U12.3 U14.3)
MUT_IN0: analog (P11.1 U7#2.6), pots (U15.5 U15.6 U17.6 U17.7)
MUT_IN1: analog (P9.1 U6.9), pots (U12.5 U12.6 U14.6 U14.7)
NetR4_2: mcu (U10.31), power (R4.2)
NetR5_2: mcu (U10.32), power (R5.2)
POT_SW0: mcu (U10.45), pots (R32.1 U16.1)
POT_SW1: mcu (U10.25), pots (R31.1 U13.1)
SCK0: mcu (U10.52), pots (U15.2 U17.2)
SCK1: mcu (U10.22), pots (U12.2 U14.2)
SCL: analog (R14.2 U5.16 U8.16), mcu (U10.16)
SDA: analog (R13.2 U5.15 U8.15), mcu (U10.15)
TCK: mcu (U10.11), debug (CON3.1)
TDI: mcu (U10.10), debug (CON3.9)
TDO: mcu (U10.12), debug (CON3.3)
TMS: mcu (U10.9), debug (CON3.5)